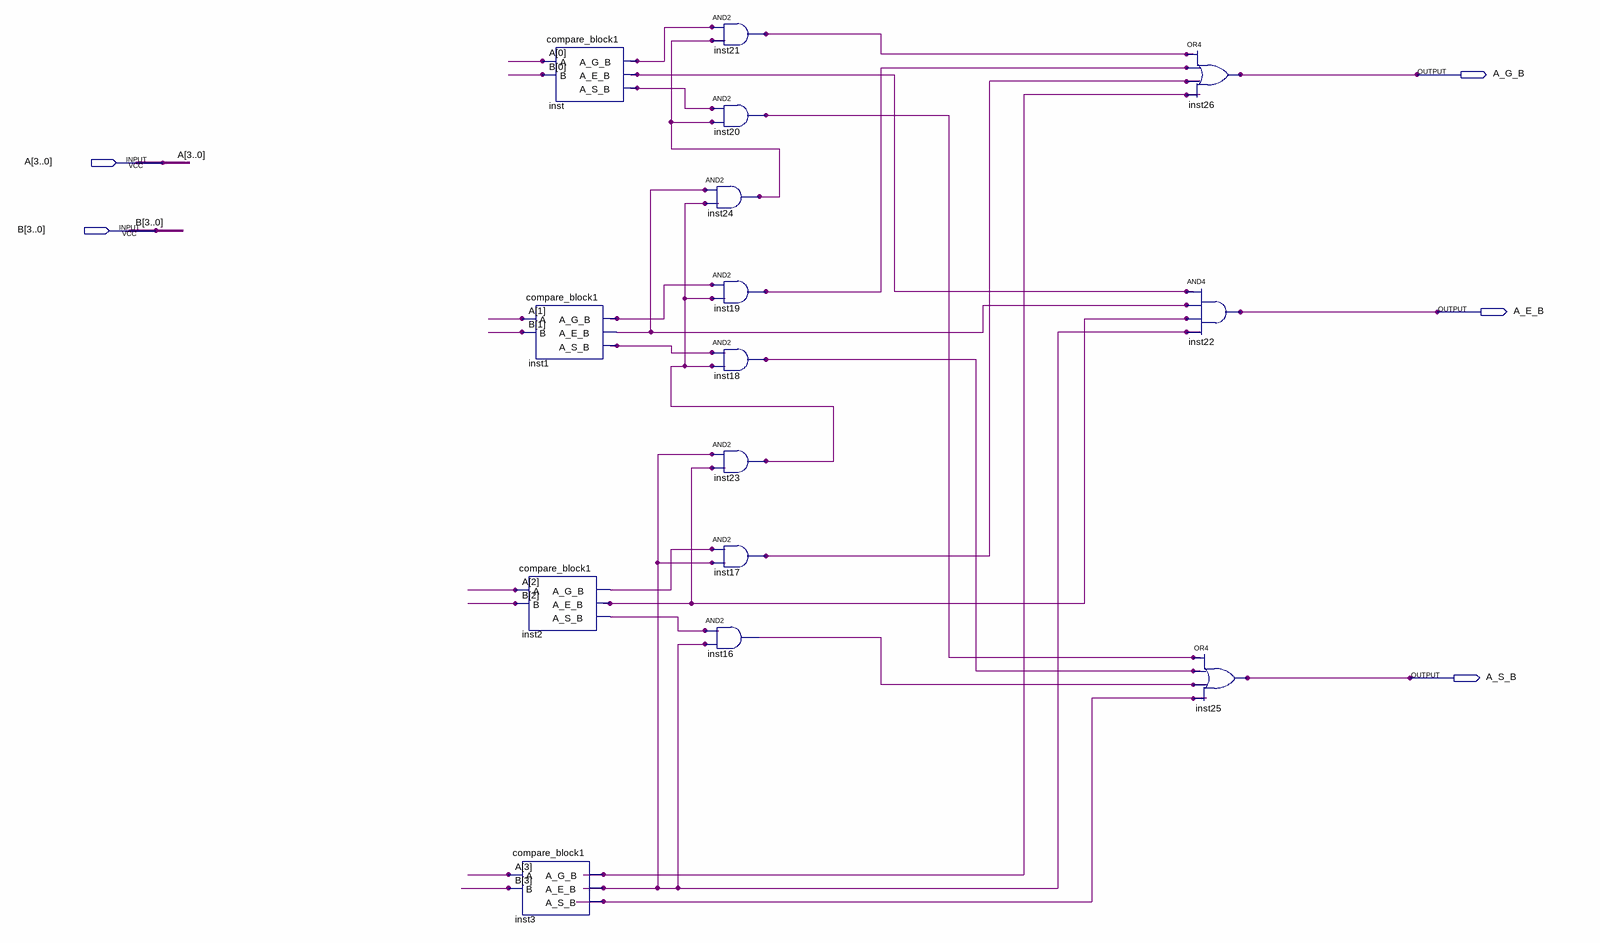
[diagram p0: schematic sheet]
// Quartus schematic compare_block4.bdf as structural Verilog: 15 symbols, 5 pins
module compare_block4 (
  input  [3:0] A,
  input  [3:0] B,
  output A_G_B,
  output A_E_B,
  output A_S_B
);

  wire inst1_a_e_b, inst1_a_g_b, inst1_a_s_b, inst2_a_e_b, inst2_a_g_b, inst2_a_s_b, inst3_a_e_b,
       inst3_a_g_b, inst3_a_s_b, inst16_out, inst17_out, inst18_out, inst19_out, inst20_out, inst21_out,
       inst23_out, inst24_out, inst_a_e_b, inst_a_g_b, inst_a_s_b;

  compare_block1 inst2 (.A(A[2]), .B(B[2]), .A_G_B(inst2_a_g_b), .A_E_B(inst2_a_e_b), .A_S_B(inst2_a_s_b));
  compare_block1 inst3 (.A(A[3]), .B(B[3]), .A_G_B(inst3_a_g_b), .A_E_B(inst3_a_e_b), .A_S_B(inst3_a_s_b));
  compare_block1 inst (.A(A[0]), .B(B[0]), .A_G_B(inst_a_g_b), .A_E_B(inst_a_e_b), .A_S_B(inst_a_s_b));
  compare_block1 inst1 (.A(A[1]), .B(B[1]), .A_G_B(inst1_a_g_b), .A_E_B(inst1_a_e_b), .A_S_B(inst1_a_s_b));
  and inst21 (inst21_out, inst_a_g_b, inst24_out);
  and inst20 (inst20_out, inst_a_s_b, inst24_out);
  and inst24 (inst24_out, inst1_a_e_b, inst23_out);
  and inst19 (inst19_out, inst1_a_g_b, inst23_out);
  and inst18 (inst18_out, inst1_a_s_b, inst23_out);
  and inst23 (inst23_out, inst3_a_e_b, inst2_a_e_b);
  and inst17 (inst17_out, inst2_a_g_b, inst3_a_e_b);
  and inst16 (inst16_out, inst2_a_s_b, inst3_a_e_b);
  or inst26 (A_G_B, inst21_out, inst19_out, inst17_out, inst3_a_g_b);
  and inst22 (A_E_B, inst_a_e_b, inst1_a_e_b, inst2_a_e_b, inst3_a_e_b);
  or inst25 (A_S_B, inst20_out, inst18_out, inst16_out, inst3_a_s_b);
endmodule
